# EAGLE schematic design1 (EAGLE 9.5.1)

## Sheet 1 of 3: Rectifier
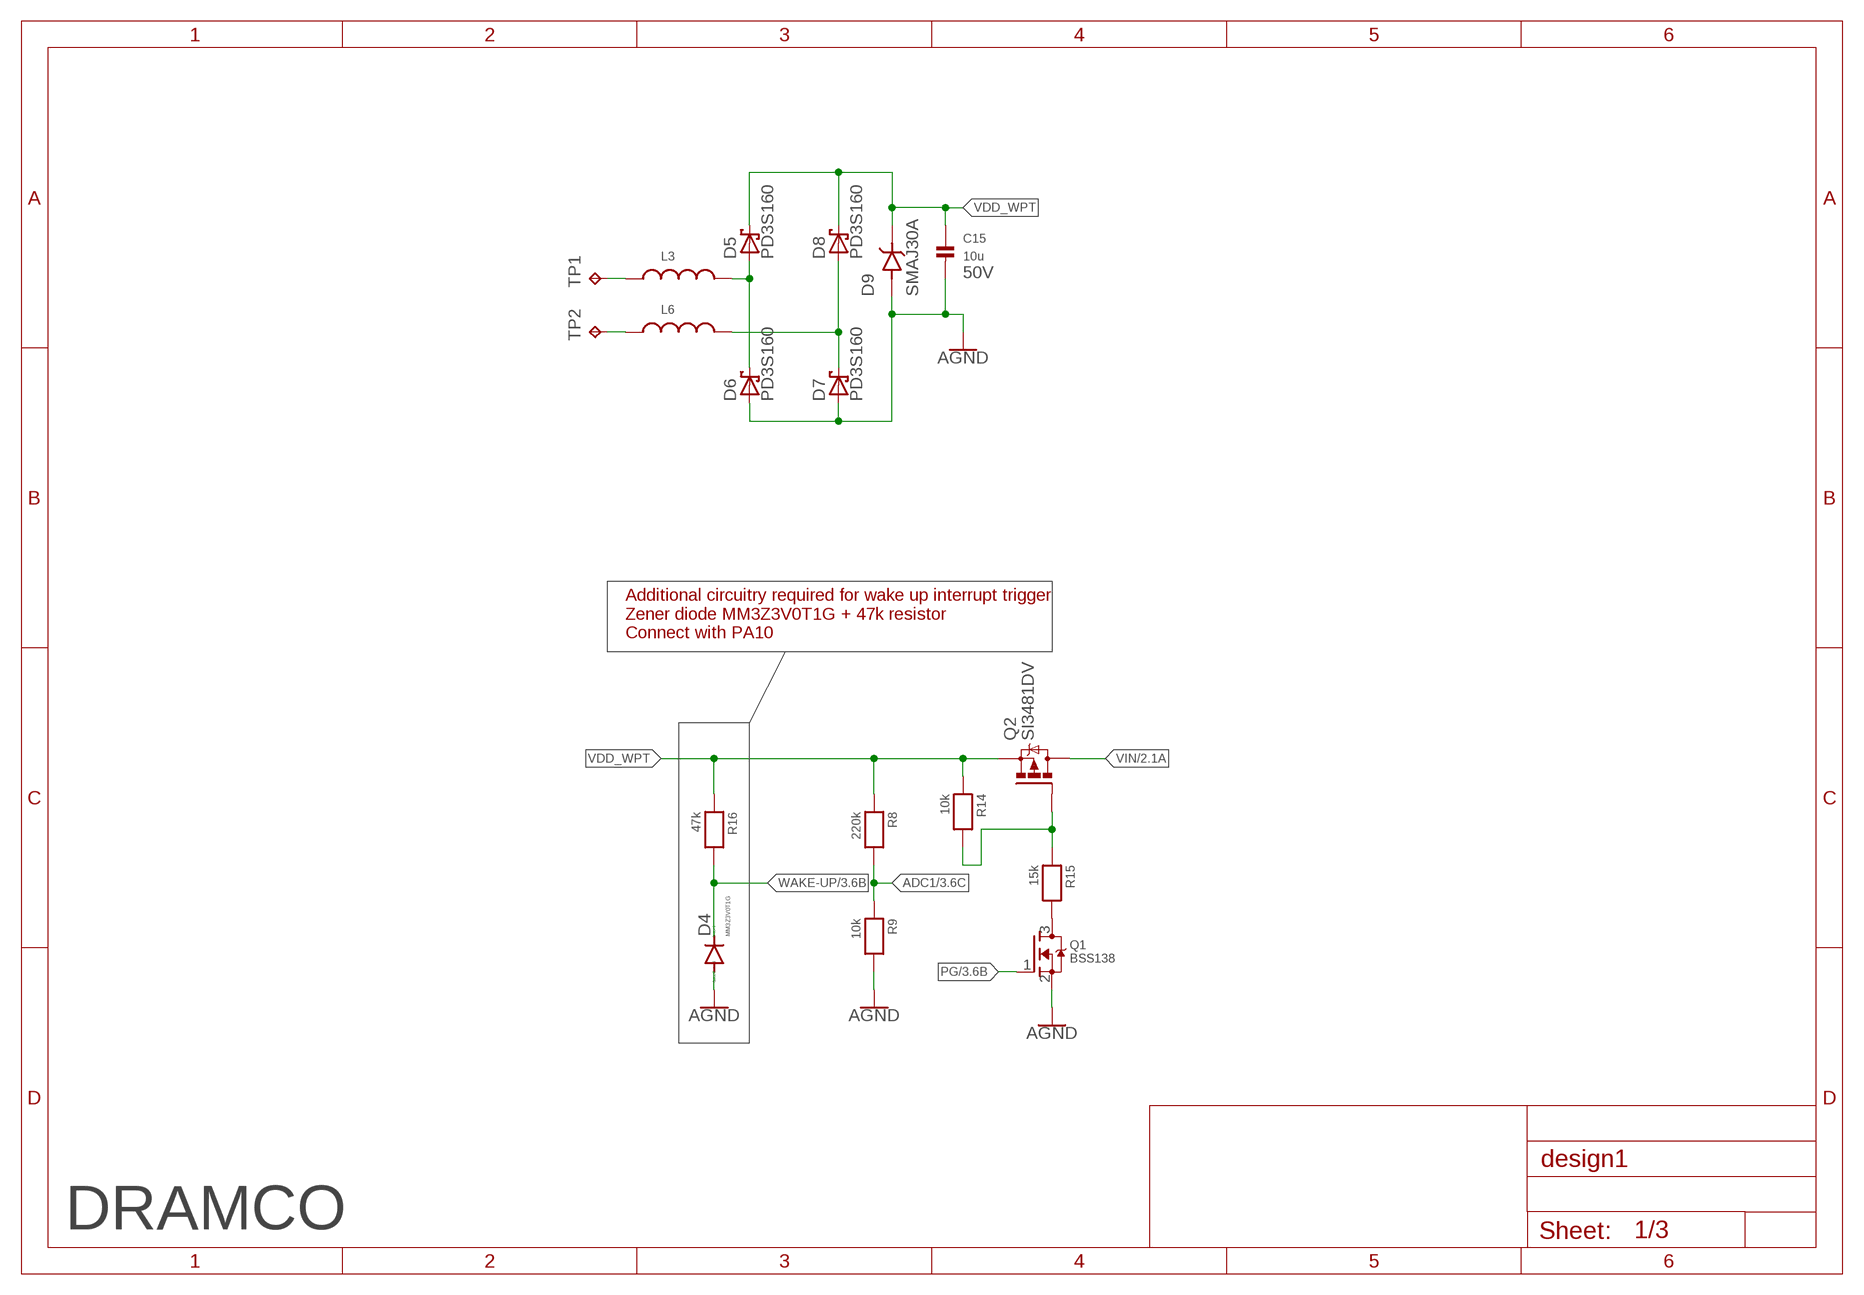
[diagram p0: schematic, sheet 1]

### Parts
C15  10u  CAP_CERAMIC1206  [1206]
D4  MM3Z3V0T1G  DIODE-SOD323-R  [SOD323-R]
D5  PD3S160  [POWERDI323]
D6  PD3S160  [POWERDI323]
D7  PD3S160  [POWERDI323]
D8  PD3S160  [POWERDI323]
D9  SMAJ30A  [DIOM5026X229N]
L3  WE-CAIR_4248_744912182  [WE-CAIR_4248]
L6  WE-CAIR_4248_744912182  [WE-CAIR_4248]
Q1  BSS138  MOSFET-NREFLOW  [SOT23-R]
Q2  SI3481DV  [TSOP-6.PAC]
R8  220k  RESISTOR0603  [0603]
R9  10k  RESISTOR0603  [0603]
R14  10k  RESISTOR0603  [0603]
R15  15k  RESISTOR0603  [0603]
R16  47k  RESISTOR0603  [0603]
TP1  TPTP20SQ  [TP20SQ]
TP2  TPTP20SQ  [TP20SQ]

### Nets
ADC1: R8.2 R9.1 ; also sheet 3
AGND: C15.2 D4.A D6.A D7.A D9.A Q1.2(S) R9.2 ; also sheet 2,3
N$4: Q1.3(D) R15.2
N$5: Q2.3(G) R14.2 R15.1
N$12: L6.1 TP2.TP
N$14: L3.1 TP1.TP
N$15: D5.A D6.C L3.2
N$16: D7.C D8.A L6.2
PG: Q1.1(G) ; also sheet 3
VDD_WPT: C15.1 D5.C D8.C D9.C Q2.4(S) R8.1 R14.1 R16.1
VIN: Q2.1(D) Q2.2(D) Q2.5(D) Q2.6(D) ; also sheet 2
WAKE-UP: D4.C R16.2 ; also sheet 3

### Notes on the sheet
- 50V
- Additional circuitry required for wake up interrupt trigger
  Zener diode MM3Z3V0T1G + 47k resistor
  Connect with PA10
- DRAMCO

## Sheet 2 of 3: Step-down converter
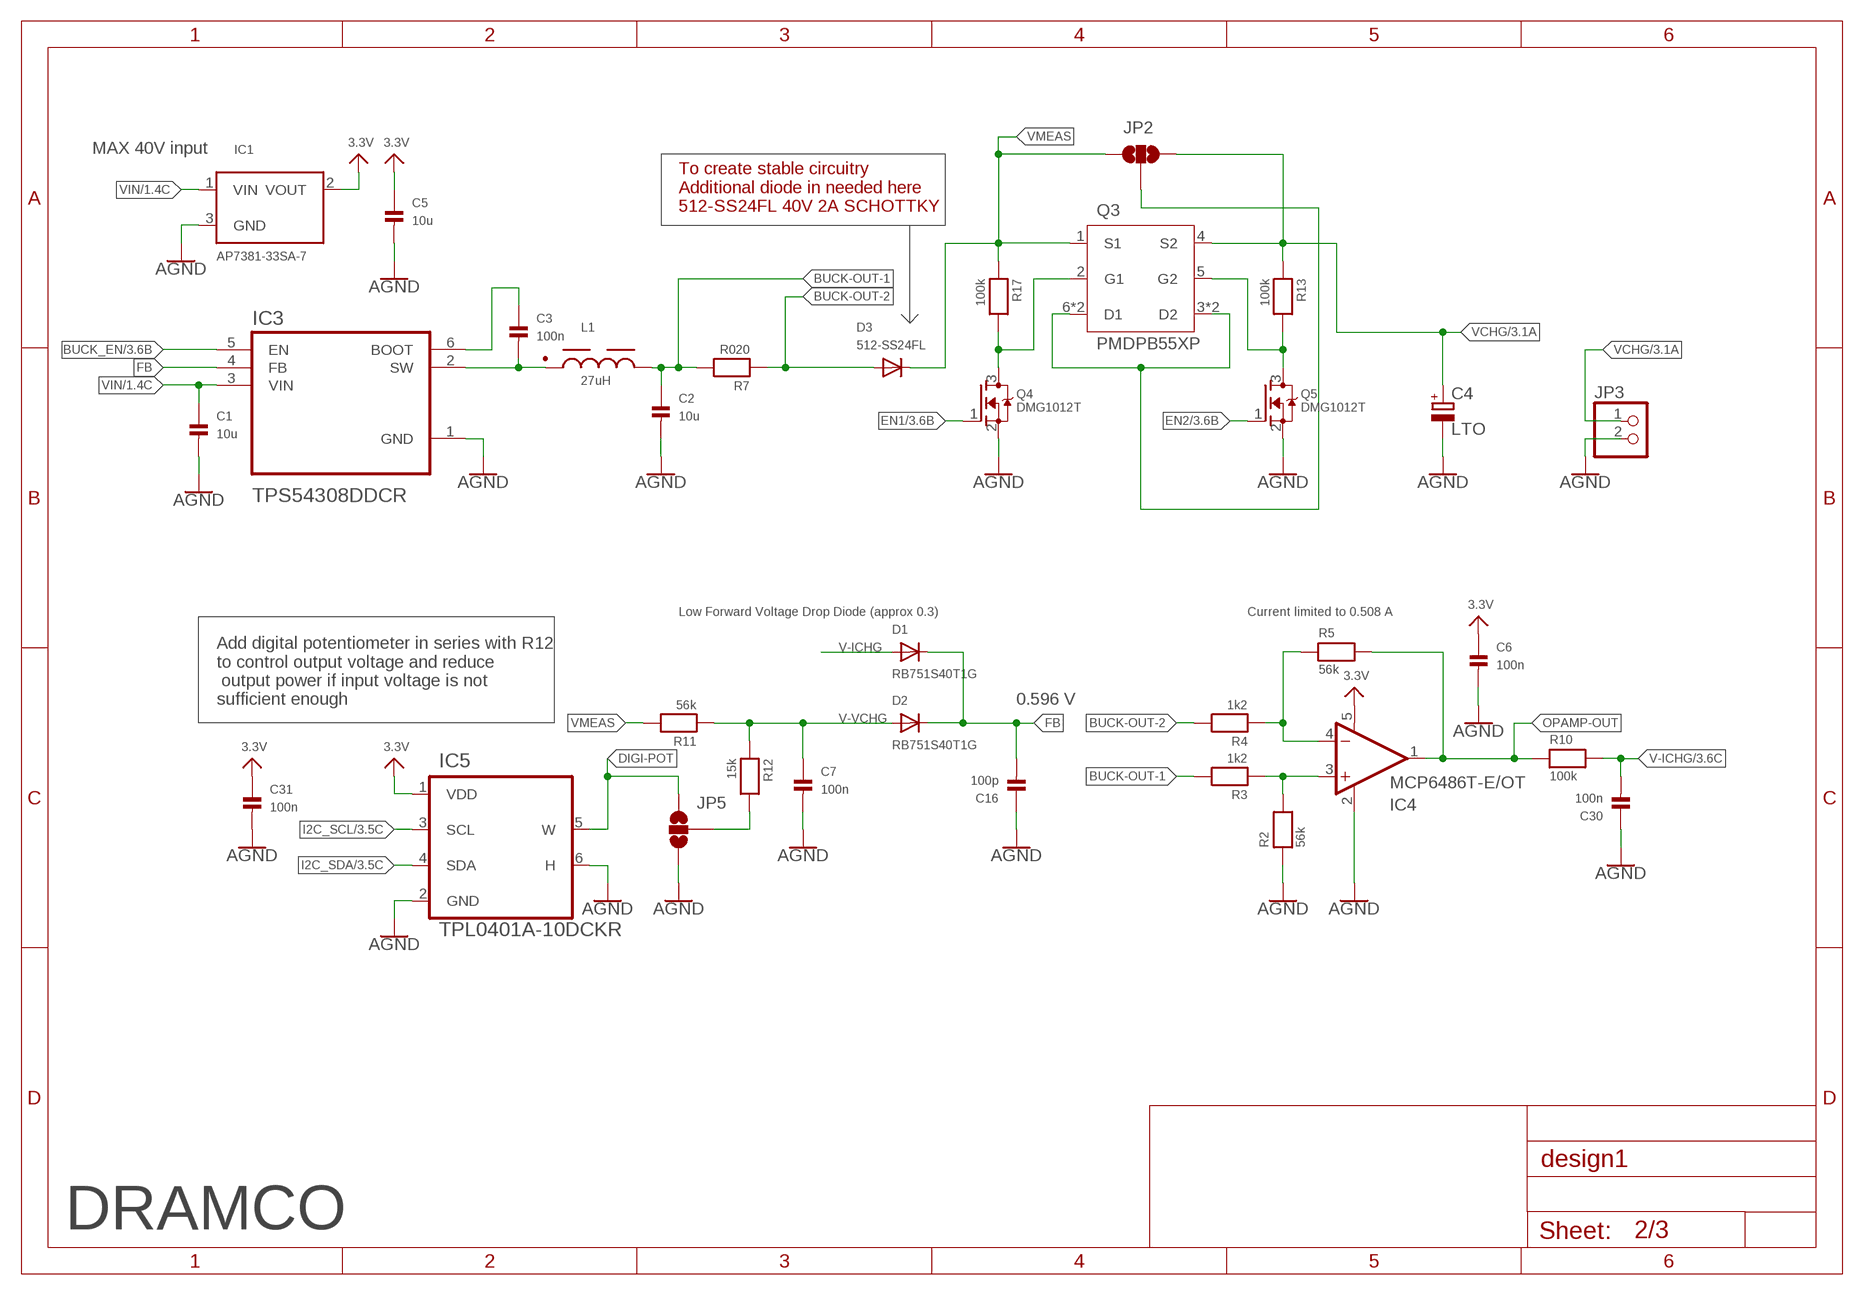
[diagram p1: schematic, sheet 2]

### Parts
C1  10u  CAP_CERAMIC0603  [0603]
C2  10u  CAP_CERAMIC0603  [0603]
C3  100n  CAP_CERAMIC0603  [0603]
C4  LTO  CPOL-EUE5-10.5  [E5-10,5]
C5  10u  CAP_CERAMIC0603  [0603]
C6  100n  CAP_CERAMIC0402  [0402]
C7  100n  CAP_CERAMIC0603  [0603]
C16  100p  CAP_CERAMIC0603  [0603]
C30  100n  CAP_CERAMIC0603  [0603]
C31  100n  CAP_CERAMIC0402  [0402]
D1  RB751S40T1G  DIODESOD-523  [SOD-523]
D2  RB751S40T1G  DIODESOD-523  [SOD-523]
D3  512-SS24FL  DIODESOD-123  [SOD-123]
IC1  AP7381-33SA-7  VREG_SOT23  [SOT23-R]
IC3  TPS54308DDCR  [SOT95P280X110-6N]
IC4  MCP6486T-E/OT  MCP6291T-E/OT  [SOT23-5]
IC5  TPL0401A-10DCKR  [SOT65P210X110-6N]
JP2  JUMPER-SMT_3_NO_NO-SILK  [SMT-JUMPER_3_NO_NO-SILK]
JP3  HEADER-1X2ROUND  [1X02_ROUND]
JP5  JUMPER-SMT_3_NO_NO-SILK  [SMT-JUMPER_3_NO_NO-SILK]
L1  27uH  WE-PD_7332_PLASTIC_7447789127  [WE-PD_7332/7345_PLASTIC_BASE]
Q3  PMDPB55XP  [SON65P200X200X65-8N]
Q4  DMG1012T  [SOT523-3]
Q5  DMG1012T  [SOT523-3]
R2  56k  RESISTOR0603  [0603]
R3  1k2  RESISTOR0603  [0603]
R4  1k2  RESISTOR0603  [0603]
R5  56k  RESISTOR0603  [0603]
R7  R020  RESISTOR0603  [0603]
R10  100k  RESISTOR0603  [0603]
R11  56k  RESISTOR0603  [0603]
R12  15k  RESISTOR0603  [0603]
R13  100k  RESISTOR0402  [0402]
R17  100k  RESISTOR0402  [0402]

### Nets
3.3V: C5.1 C6.1 C31.1 IC1.2(VOUT) IC4.5(V+) IC5.1(VDD)
AGND: C1.2 C2.2 C4.- C5.2 C6.2 C7.2 C16.1 C30.1 C31.2 IC1.3(GND) IC3.1(GND) IC4.2(V-) IC5.2(GND) IC5.6(H) JP3.2 JP5.1 Q4.2(S) Q5.2(S) R2.1 ; also sheet 1,3
BUCK-OUT-1: C2.1 L1.2 R3.2 R7.2
BUCK-OUT-2: D3.A R4.2 R7.1
BUCK_EN: IC3.5(EN) ; also sheet 3
DIGI-POT: IC5.5(W) JP5.3
EN1: Q4.1(G) ; also sheet 3
EN2: Q5.1(G) ; also sheet 3
FB: C16.2 D1.K(C) D2.K(C) IC3.4(FB)
I2C_SCL: IC5.3(SCL) ; also sheet 3
I2C_SDA: IC5.4(SDA) ; also sheet 3
N$1: JP2.2 Q3.3(D2) Q3.6(D1) Q3.7(D1) Q3.8(D2)
N$2: C3.1 IC3.6(BOOT)
N$3: C3.2 IC3.2(SW) L1.1
N$6: JP5.2 R12.2
N$8: IC4.4(-IN) R4.1 R5.1
N$9: IC4.3(+IN) R2.2 R3.1
N$17: Q3.2(G1) Q4.3(D) R17.2
N$18: Q3.5(G2) Q5.3(D) R13.2
OPAMP-OUT: IC4.1(OUT) R5.2 R10.1
V-ICHG: C30.2 D1.A R10.2 ; also sheet 3
V-VCHG: C7.1 D2.A R11.1 R12.1
VCHG: C4.+ JP2.3 JP3.1 Q3.4(S2) R13.1 ; also sheet 3
VIN: C1.1 IC1.1(VIN) IC3.3(VIN) ; also sheet 1
VMEAS: D3.C JP2.1 Q3.1(S1) R11.2 R17.1

### Notes on the sheet
- MAX 40V input
- To create stable circuitry
  Additional diode in needed here
  512-SS24FL 40V 2A SCHOTTKY
- Low Forward Voltage Drop Diode (approx 0.3) | Current limited to 0.508 A
- Add digital potentiometer in series with R12 
  to control output voltage and reduce
   output power if input voltage is not 
  sufficient enough
- 0.596 V
- DRAMCO

## Sheet 3 of 3: MCU
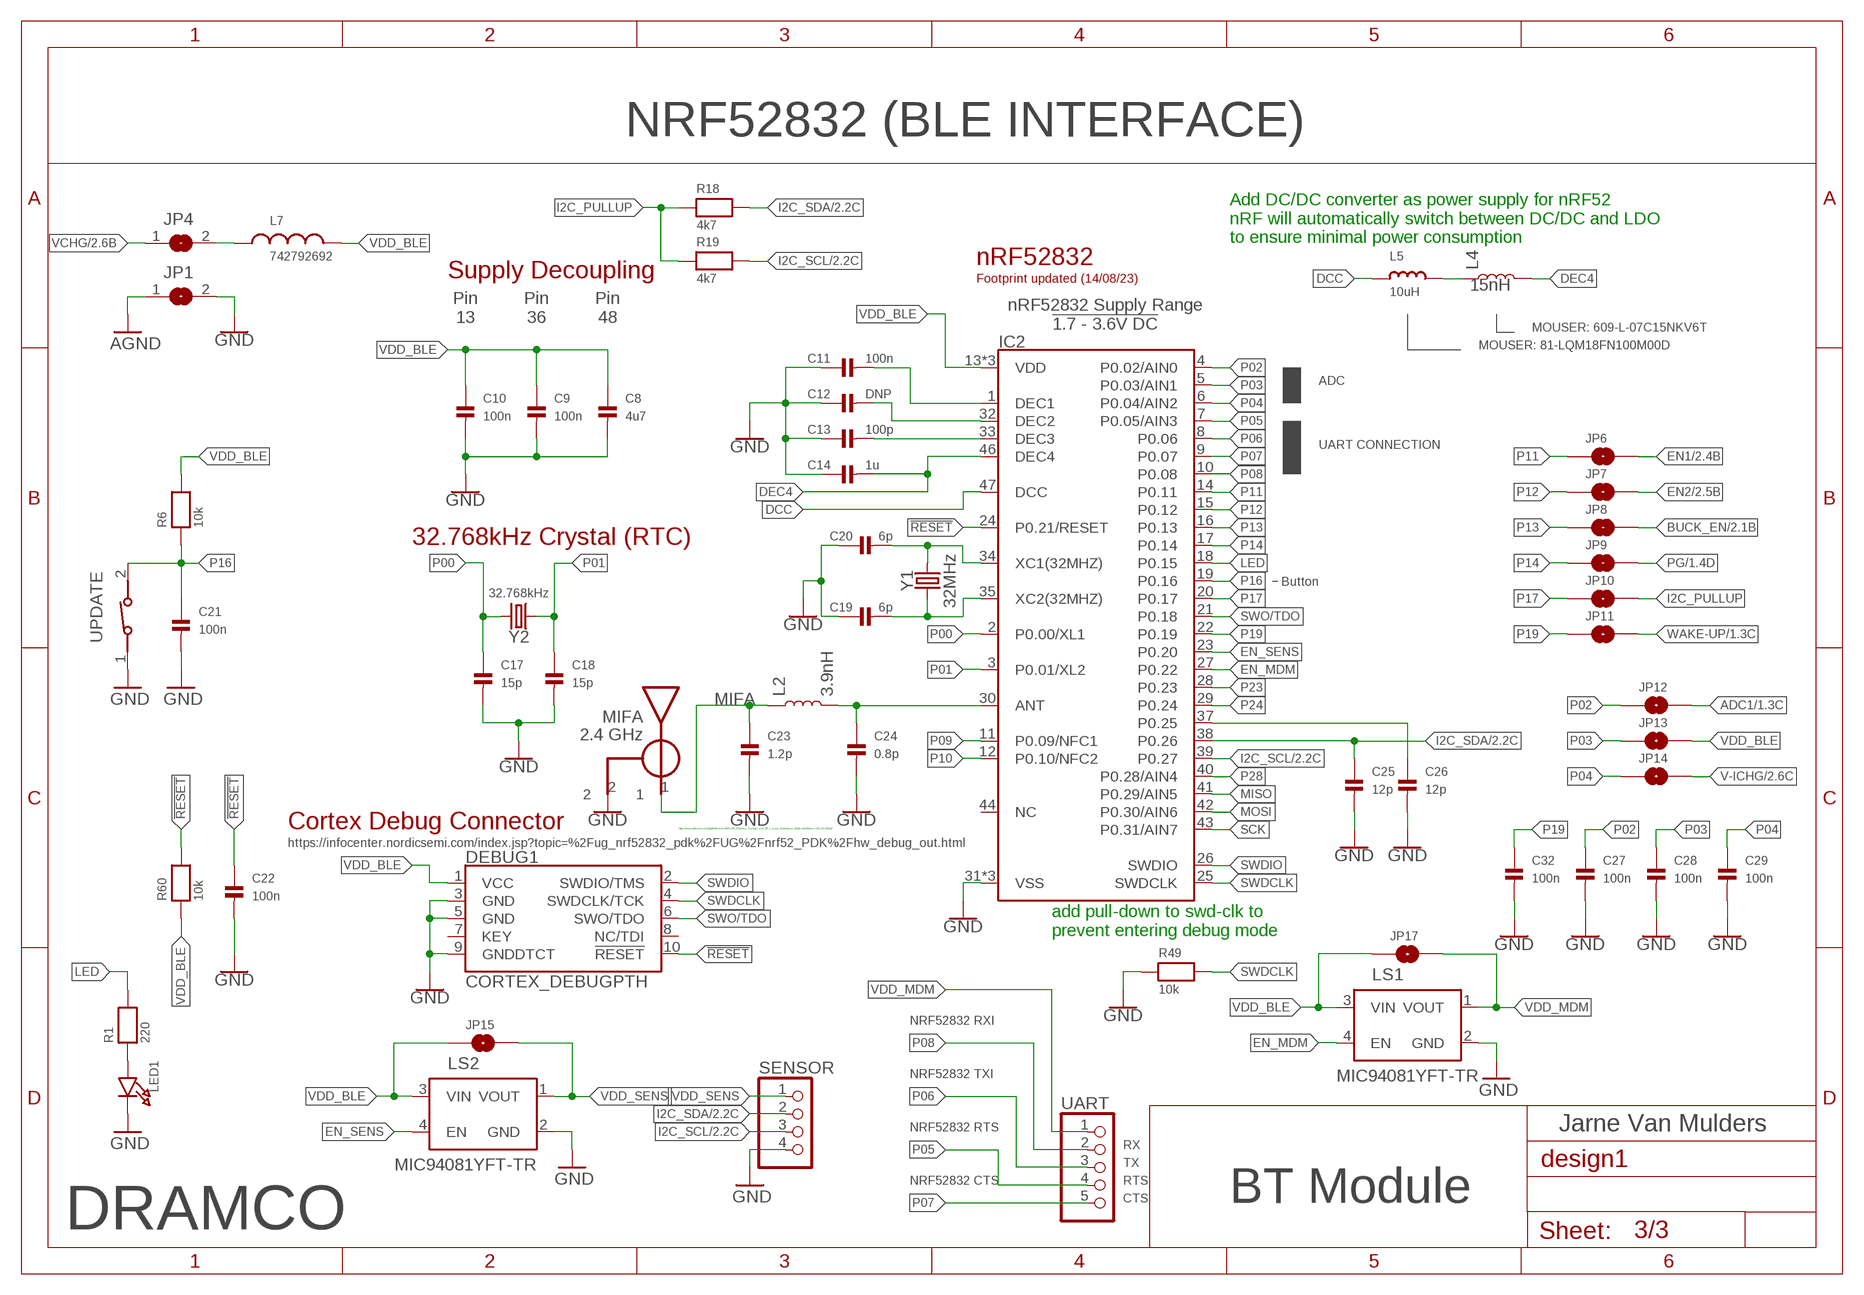
[diagram p2: schematic, sheet 3]

### Parts
C8  4u7  CAP_CERAMIC0603  [0603]
C9  100n  CAP_CERAMIC0402  [0402]
C10  100n  CAP_CERAMIC0402  [0402]
C11  100n  CAP_CERAMIC0402  [0402]
C12  DNP  CAP_CERAMIC0402  [0402]
C13  100p  CAP_CERAMIC0402  [0402]
C14  1u  CAP_CERAMIC0402  [0402]
C17  15p  CAP_CERAMIC0402  [0402]
C18  15p  CAP_CERAMIC0402  [0402]
C19  6p  CAP_CERAMIC0402  [0402]
C20  6p  CAP_CERAMIC0402  [0402]
C21  100n  CAP_CERAMIC0402  [0402]
C22  100n  CAP_CERAMIC0402  [0402]
C23  1.2p  CAP_CERAMIC0402  [0402]
C24  0.8p  CAP_CERAMIC0402  [0402]
C25  12p  CAP_CERAMIC0402  [0402]
C26  12p  CAP_CERAMIC0402  [0402]
C27  100n  CAP_CERAMIC0402  [0402]
C28  100n  CAP_CERAMIC0402  [0402]
C29  100n  CAP_CERAMIC0402  [0402]
C32  100n  CAP_CERAMIC0402  [0402]
DEBUG1  CORTEX_DEBUGPTH  [2X5-PTH-1.27MM]
IC2  NRF52832-EXTENDED  [QFN48-6X6MM-EXTENDED]
JP1  SOLDERJUMPERREFLOW_NOPASTE  [SOLDERJUMPER_REFLOW_NOPASTE]
JP4  SOLDERJUMPERREFLOW_NOPASTE  [SOLDERJUMPER_REFLOW_NOPASTE]
JP6  JUMPER-SMT_2_NO_NO-SILK  [SMT-JUMPER_2_NO_NO-SILK]
JP7  JUMPER-SMT_2_NO_NO-SILK  [SMT-JUMPER_2_NO_NO-SILK]
JP8  JUMPER-SMT_2_NO_NO-SILK  [SMT-JUMPER_2_NO_NO-SILK]
JP9  JUMPER-SMT_2_NO_NO-SILK  [SMT-JUMPER_2_NO_NO-SILK]
JP10  JUMPER-SMT_2_NO_NO-SILK  [SMT-JUMPER_2_NO_NO-SILK]
JP11  JUMPER-SMT_2_NO_NO-SILK  [SMT-JUMPER_2_NO_NO-SILK]
JP12  JUMPER-SMT_2_NO_NO-SILK  [SMT-JUMPER_2_NO_NO-SILK]
JP13  JUMPER-SMT_2_NO_NO-SILK  [SMT-JUMPER_2_NO_NO-SILK]
JP14  JUMPER-SMT_2_NO_NO-SILK  [SMT-JUMPER_2_NO_NO-SILK]
JP15  JUMPER-SMT_2_NO_NO-SILK  [SMT-JUMPER_2_NO_NO-SILK]
JP17  JUMPER-SMT_2_NO_NO-SILK  [SMT-JUMPER_2_NO_NO-SILK]
L2  3.9nH  INDUCTOR-0402-3.9NH  [0402]
L4  15nH  INDUCTOR-0402-3.9NH  [0402]
L5  10uH  INDUCTOR_0603MP  [_0603MP]
L7  742792692  WE-CBF_0603_742792692_WB_HS  [WE-CBF_0603(W=2.2)]
LED1  LED0805  [CHIPLED_0805]
LS1  MIC94081YFT-TR  [IC_MIC94081YFT-TR]
LS2  MIC94081YFT-TR  [IC_MIC94081YFT-TR]
R1  220  RESISTOR0603  [0603]
R6  10k  RESISTOR0402  [0402]
R18  4k7  RESISTOR0402  [0402]
R19  4k7  RESISTOR0402  [0402]
R49  10k  RESISTOR0402  [0402]
R60  10k  RESISTOR0402  [0402]
SENSOR  HEADER-1X4ROUND  [1X04_ROUND]
U$18  BLE-ANT  [ANT-2G4]
UART  HEADER-1X5ROUND  [1X05_ROUND]
UPDATE  434111043826  [434111043826]
Y1  32MHz  CRYSTAL-32MHZ-SMD-2.0X1.6MM  [CRYSTAL-SMD-2.0X1.6MM]
Y2  32.768kHz  CRYSTAL-32.768KHZSMD-3.2X1.5  [CRYSTAL-SMD-3.2X1.5MM]

### Nets
!RESET!: C22.1 DEBUG1.10(!RESET) IC2.24(P0.21/RESET) R60.2
ADC1: JP12.2 ; also sheet 1
AGND: JP1.1 ; also sheet 1,2
ANT: C24.1 IC2.30(ANT) L2.2
BUCK_EN: JP8.2 ; also sheet 2
DCC: IC2.47(DCC) L5.1
DEC4: C14.2 IC2.46(DEC4) L4.2
DEC5: C11.2 IC2.1(DEC1)
DEC6: C12.2 IC2.32(DEC2)
DEC8: C13.2 IC2.33(DEC3)
EN1: JP6.2 ; also sheet 2
EN2: JP7.2 ; also sheet 2
EN_MDM: IC2.27(P0.22) LS1.4(EN)
EN_SENS: IC2.23(P0.20) LS2.4(EN)
GND: C8.2 C9.2 C10.2 C11.1 C12.1 C13.1 C14.1 C17.2 C18.2 C19.1 C20.1 C21.2 C22.2 C23.2 C24.2 C25.2 C26.2 C27.2 C28.2 C29.2 C32.2 DEBUG1.3(GND) DEBUG1.5(GND) DEBUG1.9(GNDDTCT) IC2.31(VSS) IC2.45(VSS) IC2.EP(VSS) JP1.2 LED1.C LS1.2(GND) LS2.2(GND) R49.1 SENSOR.4 U$18.2 UPDATE.1
I2C_PULLUP: JP10.2 R18.1 R19.1
I2C_SCL: IC2.39(P0.27) R19.2 SENSOR.3 ; also sheet 2
I2C_SDA: C25.1 IC2.38(P0.26) R18.2 SENSOR.2 ; also sheet 2
LED: IC2.18(P0.15) R1.2
MIFA: C23.1 L2.1 U$18.1
MISO: IC2.41(P0.29/AIN5)
MOSI: IC2.42(P0.30/AIN6)
N$7: JP4.2 L7.1
N$20: LED1.A R1.1
N$50: C26.1 IC2.37(P0.25)
N$53: L4.1 L5.2
P00: C17.1 IC2.2(P0.00/XL1) Y2.P$2
P01: C18.1 IC2.3(P0.01/XL2) Y2.P$1
P02: C27.1 IC2.4(P0.02/AIN0) JP12.1
P03: C28.1 IC2.5(P0.03/AIN1) JP13.1
P04: C29.1 IC2.6(P0.04/AIN2) JP14.1
P05: IC2.7(P0.05/AIN3) UART.4
P06: IC2.8(P0.06) UART.3
P07: IC2.9(P0.07) UART.5
P08: IC2.10(P0.08) UART.2
P09: IC2.11(P0.09/NFC1)
P10: IC2.12(P0.10/NFC2)
P11: IC2.14(P0.11) JP6.1
P12: IC2.15(P0.12) JP7.1
P13: IC2.16(P0.13) JP8.1
P14: IC2.17(P0.14) JP9.1
P16: C21.1 IC2.19(P0.16) R6.1 UPDATE.2
P17: IC2.20(P0.17) JP10.1
P19: C32.1 IC2.22(P0.19) JP11.1
P23: IC2.28(P0.23)
P24: IC2.29(P0.24)
P28: IC2.40(P0.28/AIN4)
PG: JP9.2 ; also sheet 1
SCK: IC2.43(P0.31/AIN7)
SWDCLK: DEBUG1.4(SWDCLK/TCK) IC2.25(SWDCLK) R49.2
SWDIO: DEBUG1.2(SWDIO/TMS) IC2.26(SWDIO)
SWO/TDO: DEBUG1.6(SWO/TDO) IC2.21(P0.18)
V-ICHG: JP14.2 ; also sheet 2
VCHG: JP4.1 ; also sheet 2
VDD_BLE: C8.1 C9.1 C10.1 DEBUG1.1(VCC) IC2.13(VDD) IC2.36(VDD) IC2.48(VDD) JP13.2 JP15.1 JP17.1 L7.2 LS1.3(VIN) LS2.3(VIN) R6.2 R60.1
VDD_MDM: JP17.2 LS1.1(VOUT) UART.1
VDD_SENS: JP15.2 LS2.1(VOUT) SENSOR.1
WAKE-UP: JP11.2 ; also sheet 1
XC1: C20.2 IC2.34(XC1(32MHZ)) Y1.3
XC2: C19.2 IC2.35(XC2(32MHZ)) Y1.1
Unconnected: DEBUG1.7(KEY) DEBUG1.8(NC/TDI) IC2.44(NC)

### Notes on the sheet
- NRF52832 (BLE INTERFACE)
- Add DC/DC converter as power supply for nRF52
  nRF will automatically switch between DC/DC and LDO
  to ensure minimal power consumption
- nRF52832
- Supply Decoupling
- Footprint updated (14/08/23)
- nRF52832 Supply Range
  !1.7 - 3.6V DC!
- Pin
  13
- Pin
  36
- Pin
  48
- MOUSER: 609-L-07C15NKV6T
- MOUSER: 81-LQM18FN100M00D
- ADC
- UART CONNECTION
- 32.768kHz Crystal (RTC)
- Button
- Cortex Debug Connector | https://www.infineon.com/dgdl/Infineon-AN91445_Antenna_Design_and_RF_Layout_Guidelines-ApplicationNotes-v09_00-EN.pdf
- https://infocenter.nordicsemi.com/index.jsp?topic=%2Fug_nrf52832_pdk%2FUG%2Fnrf52_PDK%2Fhw_debug_out.html
- add pull-down to swd-clk to 
  prevent entering debug mode
- NRF52832 RXI
- NRF52832 TXI
- NRF52832 RTS | Jarne Van Mulders
- RX
- TX
- NRF52832 CTS | RTS
- CTS | BT Module
- DRAMCO

## Library data of the parts
C1-C3 C5-C32 = microbuilder:CAP_CERAMIC: Ceramic Capacitors 0402 - 0402 Surface Mount Capacitors 16pF 50V 5% [Digikey: 445-4899-2-ND] 18pF 50V 5% [Digikey: 490-1281-2-ND] 22pF 50V 5% [Digikey: 490-1283-2-ND] 68pF 50V 5% [Digikey: 490-1289-2-ND] 0.1uF 10V 10% [Digikey: 490-1318-2-ND] 1.0uF 6.3V 10% [Digikey: 490-1320-2-ND] 0603 - 0603 Surface Mount Capacitors 16 pF 50V 5% [Digikey: 445-5051-2-ND] 22 pF 50V [Digikey: PCC220ACVTR-ND] 33 pF 50V 5% [Digikey: 490-1415-1-ND] 56pF 50V 5% [Digikey: 490-1421-1-ND] 220pF 50V 5% [Digikey: 445-1285-1-ND] 680 pF 50V 2200 pF 50V 5% C0G [Digikey: 445-1297-1-ND] 5600 pF 100V 5% X7R [Digikey: 478-3711-1-ND] 0.1 µF 25V 10% [Digikey: PCC2277TR-ND] 0.22 µF 16V 10% X7R [Digikey: 445-1318-1-ND] 1.0 µF 25V 10% [Digikey: 445-5146-2-ND] 0603 - RF Specific 3pF 250V +/-0.1pF RF [Digikey: 712-1347-1-ND] 18 pF 250V 5% [Digikey: 478-3505-1-ND or 712-1322-1-ND] 56 pF 250V 5% C0G RF [Digikey: 490-4867-1-ND] 68 pF 250V RF [Digikey: 490-4868-1-ND] 0805 - 0805 Surface Mount Capacitors 220 pF 250V 2% RF Ceramic Capacitor [Digikey: 712-1398-1-ND] 1000 pF 50V 2% NP0 Ceramic Capacitor [Digikey: 478-3760-1-ND] 0.1 µF 25V 10% Ceramic Capacitor [Digikey: PCC1828TR-ND] 1.0 µF 16V 10% Ceramic Capacitor[Digikey: 490-1691-2-ND] 10.0 µF 10V 10% Ceramic Capacitor[Digikey: 709-1228-1-ND] 10.0 uF 16V 10% Ceramic Capacitor [Digikey: 478-5165-2-ND] 47 uF 6.3V 20% Ceramic Capacitor [Digikey: 587-1779-1-ND or 399-5506-1-ND] 1206 - 1206 Surface Mount Capacitors 47uF 10V 20% Ceramic Capacitor [Digikey: 490-5528-1-ND or 399-5508-1-ND or 445-6010-1-ND] 100uF 6.3V -20%, +80% Y5V Ceramic Capacitor (Digikey: 490-4512-1-ND, Mouser: 81-GRM31CF50J107ZE1L)
C4 = rcl:CPOL-EU: POLARIZED CAPACITOR, European symbol
D1-D3 = microbuilder:DIODE: Diode SMA Model Volts Amps Type Vf Vr Digikey # Notes SSA34-E3 40V 3A Schottky 480mV @ 3A 200uA @ 40V SSA34-E3/61TGITR-ND CDBA120-G 20V 1A Schottky 500mV @ 1A 500uA @ 20V 641-1014-6-ND REEL MBRA210 10V 2A Schottky 350mV @ 2A 700uA @ 10V MBRA210LT3 SOD-123 Model Volts Amps Type Vf Vr Order # Notes BAT54T1G 30V 200mA Schottky 800mV @ 200mA 2uA @ 25V BAT54T1GOSTR-ND B0530W 30V 500mA Schottky 430mV @ 500mA 130uA @ 30V B0530W-FDICT-ND REEL MBR120 1A 20V Schottky 340mV @ 1A MBR120VLSFT1GOSCT-ND SOD-323 Model Volts Amps Type Vf Vr Order # Notes PMEG2005EJ 20V 500mA Schottky 355mV @ 500mA 568-4110-1-ND ZLLS410 10V 570mA Schottky 380mV @ 570mA ZLLS410CT-ND 1N4148WS 75V 150mA Silicon/Simple 1V 1N4148WSFSCT-ND REEL SOD-523 Model Volts Amps Type Vf Vr Order # Notes BAT54XV2 30V 200mA Schottky 0.8V @ 100mA BAT54XV2CT-ND TB751S 30V 30mA Schottky RB751S-40TE61CT-ND SOT23-R/W (R = Solder Paste/Reflow Ovens, W = Hand-Soldering) Model Volts Amps Type Vf Vr Order # Notes BAT54FILM 40V 300mA Schottky 497-7162-1-ND
D4 = diode:DIODE-: DIODE
D5-D8 = diode:PD3S160: 1.0A SURFACE MOUNT SCHOTTKY BARRIER RECTIFIER POWERDI ® 323 Source: http://www.diodes.com/datasheets/ds30899.pdf
D9 = SMAJ30A:SMAJ30A: SMAJ Series 48.4 V 0.4 kW Surface Mount Uni-Directional TVS Diode - DO-214AC Check prices <https://pricing.snapeda.com/parts/SMAJ30A/Littelfuse/view-part?ref=eda>; AVAILABILITY: Good; DESCRIPTION: 48.4V Clamp 8.3A Ipp Tvs Diode Surface Mount DO-214AC (SMA); MF: Littelfuse; MP: SMAJ30A; PACKAGE: DO-214 Littelfuse; PRICE: None; PURCHASE-URL: https://pricing.snapeda.com/search/part/SMAJ30A/?ref=eda
DEBUG1 = SparkFun-Connectors:CORTEX_DEBUG: Cortex Debug Connector Datasheet <http://infocenter.arm.com/help/topic/com.arm.doc.faqs/attached/13634/cortex_debug_connectors.pdf>
IC1 = microbuilder:VREG_SOT23: SOT23 Fixed Voltage Regulators Part Current Out V Out V In V Dropout Digikey Part No. AP7313 150mA 3.3V 3.5-6V 0.15V @ 150mA AP7313-33SAG-7DICT-ND
IC2 = SparkFun-RF:NRF52832-EXTENDED
IC3 = TPS54308DDCR:TPS54308DDCR: Check availability <https://pricing.snapeda.com/parts/TPS54308DDCR/Texas%20Instruments/view-part?ref=eda>; AVAILABILITY: In Stock; DESCRIPTION: 4.5-V to 28-V Input, 3-A output, synchronous 350-kHz FCCM step-down converter; MF: Texas Instruments; MP: TPS54308DDCR; PACKAGE: SOT-23-THN-6 Texas Instruments; PRICE: None; PURCHASE-URL: https://pricing.snapeda.com/search/part/TPS54308DDCR/?ref=eda
IC4 = SparkFun-Retired:MCP6291: Rail to rail OpAmp with 10MHz GBP Prototype: IC-11991; PROD_ID: IC-11991; VALUE: MCP6291T
IC5 = TPL0401A-10DCKR:TPL0401A-10DCKR: Check availability <https://pricing.snapeda.com/parts/TPL0401A-10DCKR/Texas%20Instruments/view-part?ref=eda>; AVAILABILITY: In Stock; CHECK_PRICES: https://www.snapeda.com/parts/TPL0401A-10DCKR/Texas+Instruments/view-part/?ref=eda; DESCRIPTION: 128-tap single-channel digital potentiometer (digipot) with I2C interface (address 0101110); MF: Texas Instruments; MP: TPL0401A-10DCKR; PACKAGE: SOT-SC70-6 Texas Instruments; PRICE: None; PURCHASE-URL: https://pricing.snapeda.com/search?q=TPL0401A-10DCKR&ref=eda; SNAPEDA_LINK: https://www.snapeda.com/parts/TPL0401A-10DCKR/Texas+Instruments/view-part/?ref=snap
JP1 JP4 = microbuilder:SOLDERJUMPER: SMD Solder JUMPER Solder the two pads together to create a connection, or remove the solder to break it. REFLOW - Use this footprint for solder paste and reflow ovens. WAVE - Use this footprint for hand-soldering (larger pads). CLOSED - Has a trace between the two pads to ensure it is closed by default. The trace needs to be cut to disable the jumper, and can be closed again by creating a solder bridge between the two pads.
JP2 JP5 = SparkFun-Jumpers:JUMPER-SMT_3_NO: Normally open jumper This jumper has three pads in close proximity to each other. Apply solder to close the connection(s).
JP3 = microbuilder:HEADER-1X2: PIN HEADER
JP6-JP15 JP17 = SparkFun-Jumpers:JUMPER-SMT_2_NO: Normally open jumper This jumper has two pads in close proximity to each other. Apply solder to close the connection. Round pads are easier to solder for beginners, but are a lot larger. SparkFun Product that uses the round pads: SparkFun EL Sequencer <https://www.sparkfun.com/products/12781>
L1 = EMCComponents (rev19b):WE-PD_7332_PLASTIC: SMD Shielded Power Inductor Characteristics Magnetically shielded version which results in a low leakage field High Saturation currents up to 25 A Very low self-losses at high switching frequency‘s Wide inductances spectrum available at all sizes Operating temperature: –40 °C to +125 °C Applications Perfectly suitable for switching regulators with extremely high efficiency Integrated DC/DC- converter Switching regulators with low operating voltages (Graphic cards, embedded PC-Cards, Mainboards) Plastic base: Because of the one piece construction these are more suitable for high vibration or shock applications <http://katalog.we-online.de/media/images/v2/Family_WE-PD.jpg> Details see: http://katalog.we-online.de/en/pbs/WE-PD? Updated by Dan Xu 2014-07-08 2014 (C) Wurth Elektronik; WE-NUMBER: 7447789127/27uH
L2 = nrf52832-breakout-temp:INDUCTOR: Inductors; PROD_ID: NDUC-13457
L3 L6 = PowerMagnetics (rev18e):WE-CAIR_4248: WE-CAIR Air coil Characteristics Inductance values from 1.65nH up to 120 nH Very high quality factor >100 High self-resonant frequency High currents up to 3.5 A 5%(10%) Inductance tolerance Pick and place process possible Good solderability (Tinned connector pins) Operating temperature: –40 °C to +125 °C Applications Especially for RF application Ideal for high current applications Broad band filter RF-Decoupling <http://katalog.we-online.de/media/images/v2/Family_WE-CAIR_4C.jpg> Details see: http://katalog.we-online.de/en/pbs/WE-CAIR Created on 2014-05-19 2014 (C) Wurth Elektronik; WE-NUMBER: 744912182/82nH
L4 = nrf52832-breakout-temp:INDUCTOR: Inductors; PROD_ID: NDUC-13457; VALUE: 3.9nH
L5 = microbuilder:INDUCTOR: Inductors
L7 = PowerMagnetics (rev18e):WE-CBF_0603: WE-CBF SMD EMI Suppression Ferrite Bead Characteristics Reliable Ni-Sn electrodes High rated current up to 6 A Operating temperature: –55 ºC to +125 ºC Applications Perfect as data lined filter and for uncoupling of distribution voltage Variant abbreviation WB means WIDE BAND HS means HIGH SPEED HC means HIGH CURRENT <http://katalog.we-online.de/media/images/v2/Family_WE-CBF.jpg> Details see: http://katalog.we-online.de/en/pbs/WE-CBF Updated on 2014-06-19 2014 (C) Wurth Elektronik; WE-NUMBER: 742792692/1800Ω(Z@100MHz)
LED1 = microbuilder:LED: LED 0603 - 0603 Surface Mount Package 2mA: Green LED - Low Power (3.9mcd, 2ma, 1.7Vf) - Digikey: 475-2709-2-ND Orange LED - Low Power (9.8mcd, 2ma, 1.8Vf) - Digikey: 475-1194-2-ND Red LED - Low Power (5mcd, 2ma, 1.8Vf) - Digikey: 475-1195-2-ND Yellow LED - Low Power (7mcd, 2ma, 1.8Vf) - Digikey: 475-1196-2-ND 5mA: Blue LED - Low Power (17mcd, 5ma, 2.9Vf) - Digikey: LNJ937W8CRACT-ND 0805 - 0805 Surface Mount Package 2mA: Red LED (8.8mcd, 2mA, 1.8Vf, Clear) - Low Power [Digikey: 475-2510-1-ND] Green LED (5mcd, 2mA, 1.8Vf, Clear) - Low Power [Digikey: 475-2730-1-ND] Yellow LED (11.3mcd, 2mA, 1.8Vf, Clear) - Low Power [Digikey: 475-2555-1-ND] 20mA: Red LED (104mcd, 20mA, Diffused) - LS R976 [Digikey: 475-1278-6-ND] Red LED (12mcd, 20mA, 2.0Vf, Clear) - APT2012EC [Digikey: 754-1128-1-ND] Green LED (15mcd, 20mA, 2.2Vf, Clear) - APT2012GC [Digikey: 754-1131-1-ND] Orange LED (160mcd, 20mA, 2.1Vf, Clear) - APT2012SECK [Digikey: 754-1130-1-ND] 1206 - 1206 Surface Mount Package Green LED (26mcd, 20mA, Diffused) - LG N971 [Digikey: 475-1407-6-ND] Red LED (15mcd, 20mA, Diffused) - LH N974 [Digikey: 475-1416-6-ND]
LS1 LS2 = MIC94081YFT-TR:MIC94081YFT-TR: Power Switch/Driver 1:1 P-Channel 2A 4-TMLF® (0.85x0.85) Check prices <https://pricing.snapeda.com/parts/MIC94081YFT-TR/Microchip/view-part?ref=eda>; AVAILABILITY: In Stock; DESCRIPTION: Power Switch/Driver 1:1 P-Channel 2A 4-TMLF® (0.85x0.85); MF: Microchip; MP: MIC94081YFT-TR; PACKAGE: UFDFN-4 Microchip; PRICE: None
Q1 = microbuilder:MOSFET-N: N-Channel Mosfet LEGEND VDS: Voltage Drain-Source ID: Drain Current RDS(ON): Drain-Source On-State Resistance VGS(TH): Gate-Source Threshold Voltage CISS: Drain-Source Input Capacitance SOT-23 Name VDS ID RDS(ON) VGS(TH) CISS Order Number 2N7002E 60V 260mA 2.5 Ohm 2.5V @ 250uA 26.7pF @ 25V 2N7002ET1GOSTR-ND BSH103 30V 850mA 400 mOhm 400mV @ 1mA 83pF @ 24V BSH103,235-ND BSS138 60V 320mA 1.6 Ohm 1.5V @ 250uA 50pF @ 10V Mouser: 771-BSS138PW115 DMN2075U-7 20V 4.2A 38 mOhm 1V @ 250 uA 594.3pF @ 10V DMN2075U-7DICT-ND * BSS138 good choice for I2C level-shifting
Q2 = transistor-power:SI3481DV: P-Channel 30-V (D-S) MOSFET Source: http://www.vishay.com/docs/72105/72105.pdf
Q3 = PMDPB55XP:PMDPB55XP
Q4 Q5 = microbuilder:DMG1012T
R1-R19 R49 R60 = microbuilder:RESISTOR: Resistors 0402 - 0402 Surface Mount Package 22 Ohm 1% 1/16W [Digikey: 311-22.0LRTR-ND] 33 Ohm 5% 1/16W 1.0K 5% 1/16W 1.5K 5% 1/16W 2.0K 1% 1/16W 10.0K 1% 1/16W [Digikey: 311-10.0KLRTR-ND] 10.0K 5% 1/16W [Digikey: RMCF0402JT10K0TR-ND] 12.1K 1% 1/16W [Digikey: 311-22.0LRTR-ND] 100.0K 5% 1/16W 0603 - 0603 Surface Mount Package 0 Ohm 1/10 Watt 1% Resistor 15 Ohm 1/10 Watt 1% Resistor 33 Ohm 1/10 Watt 1% Resistor 49.9 Ohm 1/10 Watt 1% Resistor 100 Ohm 1/10 Watt 1% Resistor 150 Ohm 1/10 Watt 1% Resistor 240 Ohm 1/10 Watt 1% Resistor 390 Ohm 1/10 Watt 1% Resistor 560 Ohm 1/10 Watt 1% Resistor 680 Ohm 1/10 Watt 1% Resistor 750 Ohm 1/10 Watt 1% Resistor 1.0K Ohm 1/10 Watt 1% Resistor 1.5K Ohm 1/10 Watt 1% Resistor 2.0K Ohm 1/10 Watt 1% Resistor 2.2K Ohm 1/10 Watt 1% Resistor 3.3K Ohm 1/10 Watt 1% Resistor 4.7K Ohm 1/10 Watt 1% Resistor 10.0K Ohm 1/10 Watt 1% Resistor 12.0K Ohm 1/10 Watt 1% Resistor 12.1K Ohm 1/10 Watt 1% Resistor 20.0K Ohm 1/10 Watt 1% Resistor 33.0K Ohm 1/10 Watt 1% Resistor 100.0K Ohm 1/10 Watt 1% Resistor 0805 - 0805 Surface Mount Package 0 Ohm 1/8 Watt 1% Resistor 33 Ohm 1/8 Watt 1% Resistor 100 Ohm 1/8 Watt 1% Resistor 150 Ohm 1/8 Watt 1% Resistor 200 Ohm 1/8 Watt 1% Resistor 240 Ohm 1/8 Watt 1% Resistor 330 Ohm 1/8 Watt 1% Resistor 390 Ohm 1/8 Watt 1% Resistor 470 Ohm 1/8 Watt 1% Resistor 1.0K Ohm 1/8 Watt 1% Resistor 1.5K Ohm 1/8 Watt 1% Resistor 2.0K Ohm 1/8 Watt 1% Resistor 4.7K Ohm 1/8 Watt 1% Resistor 5.1K Ohm 1/8 Watt 1% Resistor 5.6K Ohm 1/8 Watt 1% Resistor 10.0K Ohm 1/8 Watt 1% Resistor 22.0K Ohm 1/8 Watt 1% Resistor 33.0K Ohm 1/8 Watt 1% Resistor 100K Ohm 1/8 Watt 1% Resistor 1206 - 1206 Surface Mount Package 2012 - 2010 Surface Mount Package 0.11 Ohm 1/2 Watt 1% Resistor - Digikey: RHM.11UCT-ND
SENSOR = microbuilder:HEADER-1X4: PIN HEADER
TP1 TP2 = testpad:TP: Test pad
U$18 = ble-antenna:BLE-ANT
UART = microbuilder:HEADER-1X5: PIN HEADER
UPDATE = Eagle_SWITCHES (rev18c):434111043826: 6.0x3.5 mm SMD WS-TASV <http://katalog.we-online.de/media/images/v2/Family_WS-TASV_6.0x3.jpg> Details see: http://katalog.we-online.de/em/datasheet/4341x1xxx8x6.pdf 2015 (C) Wurth Elektronik
Y1 = nrf52832-breakout-temp:CRYSTAL-32MHZ: 32MHz Crystal Digikey Example <http://www.digikey.com/product-detail/en/murata-electronics-north-america/XRCGB32M000F2P00R0/490-9769-1-ND/4952013> Frequency: 32MHz Frequency Stability: ±20ppm Frequency Tolerance: ±20ppm Load Capacitance: 6pF; PROD_ID: XTAL-13459
Y2 = SparkFun-Clocks:CRYSTAL-32.768KHZ: 32.768kHz Crystal Frequency: 32.768kHz Frequency Stability: ±20ppm Load Capacitance: 12.5pF (PTH-2X6 & SMD-3.2X1.5), 6pF (SMD-2X6); PROD_ID: XTAL-13062